# EAGLE design STorM32 NT logger v10 (EAGLE 6.5.0)
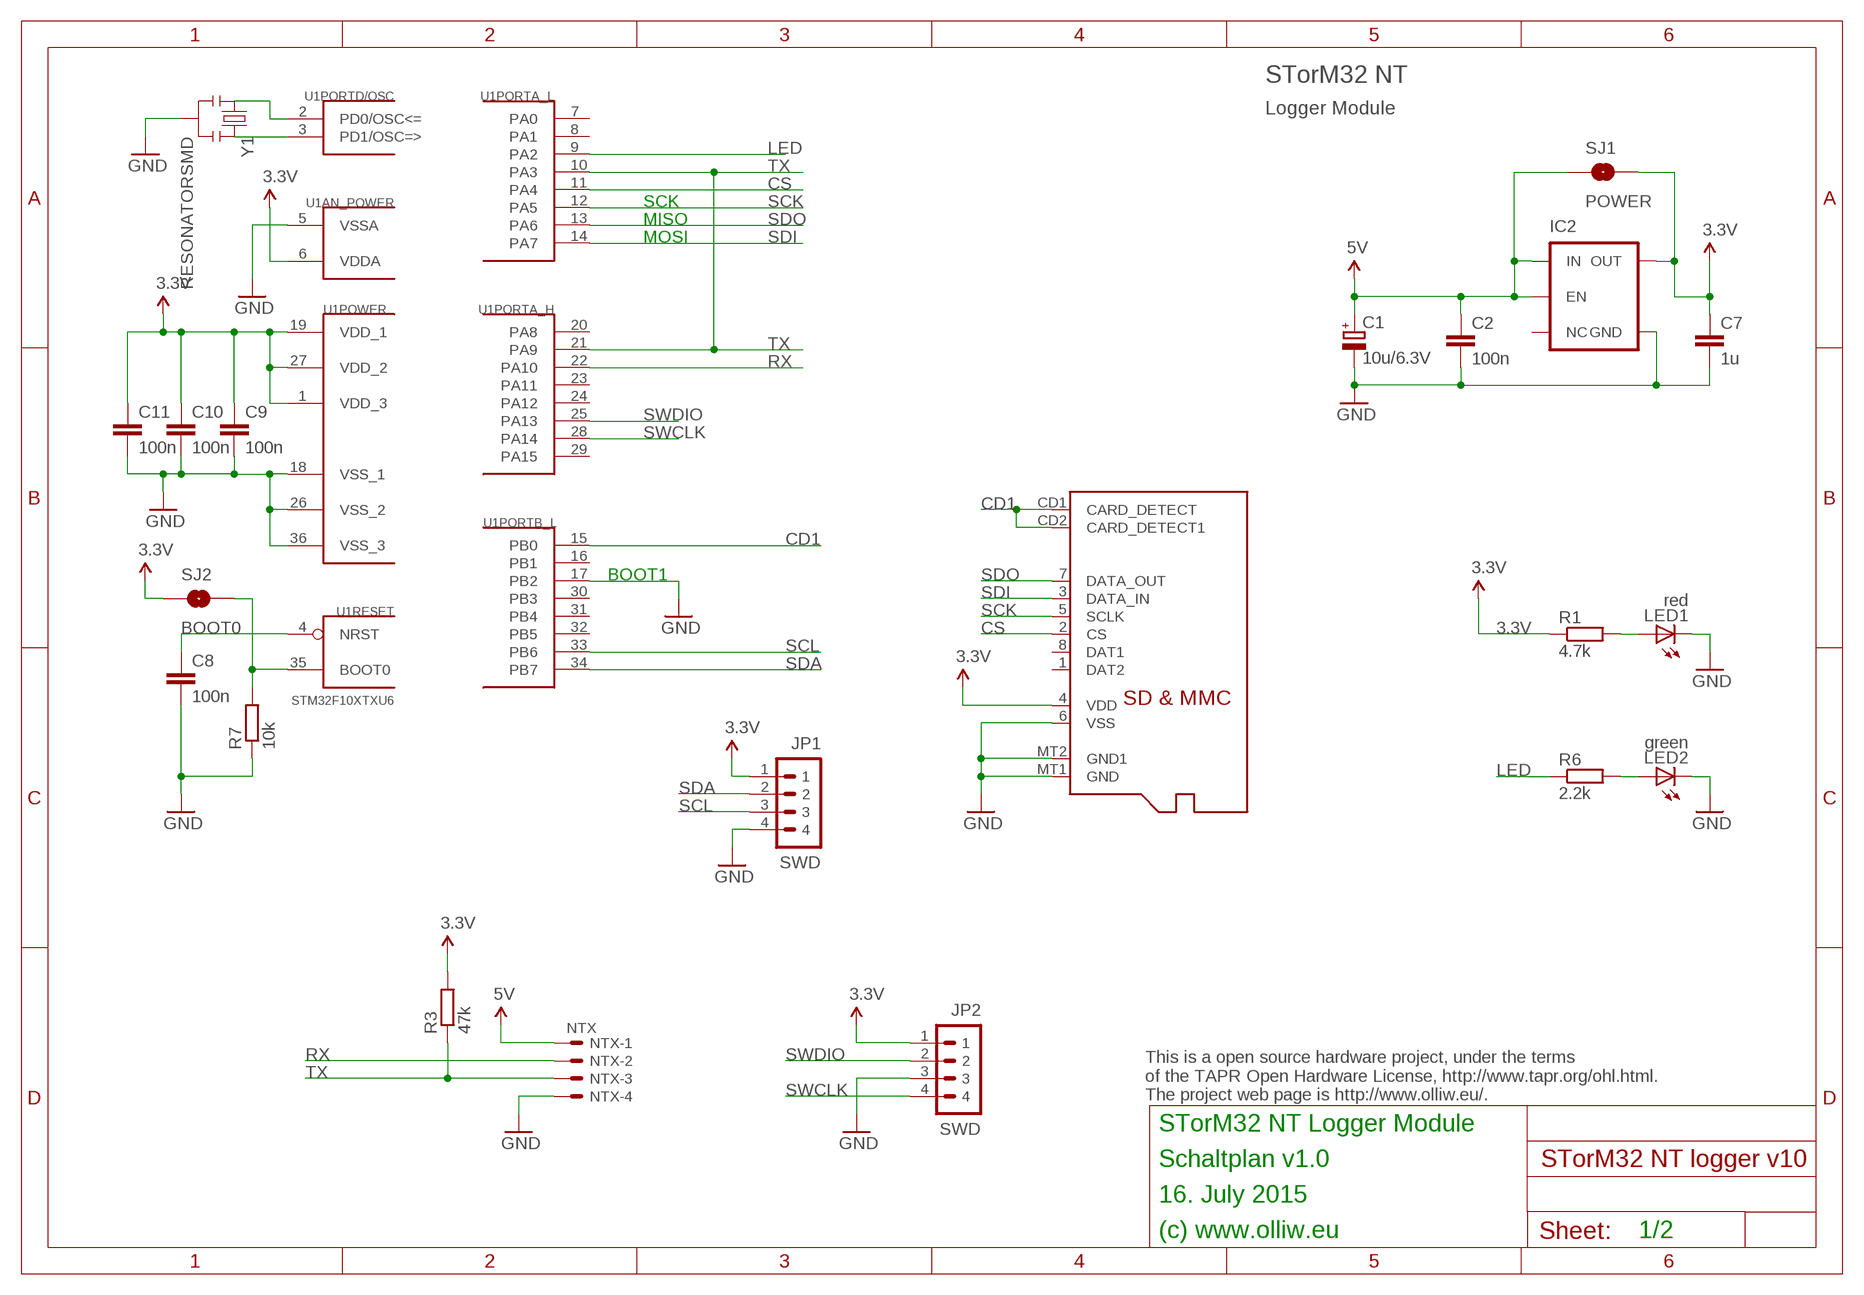
[diagram p0: schematic, sheet 1]

## Parts
C1  10u/6.3V  CPOL-EUSMCB  [SMC_B]
C2  100n  C-EUC0603  [C0603]
C7  1u  C-EUC0603  [C0603]
C8  100n  C-EUC0603  [C0603]
C9  100n  C-EUC0603  [C0603]
C10  100n  C-EUC0603  [C0603]
C11  100n  C-EUC0603  [C0603]
IC2  V_REG_TPS76433SOT23-5  [SOT23-5]
JP1  SWD  P4X1_1P27-OCT_BILEX  [4X1_1P27_OCT_BILEX]
JP2  SWD  P4X1_1P27-OCT_BILEX  [4X1_1P27_OCT_BILEX]
LED1  red  LEDCHIPLED_0603  [CHIPLED_0603]
LED2  green  LEDCHIPLED_0603  [CHIPLED_0603]
NTX  NTX  SM04B-SRSS-TB  [SM04B-SRSS-TB]
R1  4.7k  R-EU_R0603  [R0603]
R3  47k  R-EU_R0603  [R0603]
R6  2.2k  R-EU_R0603  [R0603]
R7  10k  R-EU_R0603  [R0603]
SJ1  POWER  SOLDERJUMPERNO  [SJ_2S-NO]
SJ2  BOOT0  SOLDERJUMPERNO  [SJ_2S-NO]
U1  STM32F10XTXU6  [VFQFPN36]
U$1  MICROSD  [MICROSD]
Y1  RESONATORSMD  [RESONATOR-SMD]

## Nets
3.3V: C7.1 C9.1 C10.1 C11.1 IC2.5(OUT) JP1.1 JP2.1 R1.1 R3.2 SJ1.2 SJ2.1 U1.1(POWER:VDD_3) U1.6(AN_POWER:VDDA) U1.19(POWER:VDD_1) U1.27(POWER:VDD_2) U$1.4(VDD)
5V: C1.+ C2.1 IC2.1(IN) IC2.3(EN) NTX.1 SJ1.1
CD1: U1.15(PORTB_L:PB0) U$1.CD1(CARD_DETECT) U$1.CD2(CARD_DETECT1)
CS: U1.11(PORTA_L:PA4) U$1.2(CS)
GND: C1.- C2.2 C7.2 C8.2 C9.2 C10.2 C11.2 IC2.2(GND) JP1.4 JP2.3 LED1.C LED2.C NTX.4 R7.1 U1.5(AN_POWER:VSSA) U1.17(PORTB_L:PB2) U1.18(POWER:VSS_1) U1.26(POWER:VSS_2) U1.36(POWER:VSS_3) U$1.6(VSS) U$1.MT1(GND) U$1.MT2(GND1) Y1.2
LED: R6.1 U1.9(PORTA_L:PA2)
N$1: C8.1 U1.4(RESET:NRST)
N$2: LED2.A R6.2
N$3: R7.2 SJ2.2 U1.35(RESET:BOOT0)
N$5: U1.2(PORTD/OSC:PD0/OSC<=) Y1.1
N$6: U1.3(PORTD/OSC:PD1/OSC=>) Y1.3
N$9: LED1.A R1.2
RX: NTX.2 U1.22(PORTA_H:PA10)
SCK: U1.12(PORTA_L:PA5) U$1.5(SCLK)
SCL: JP1.3 U1.33(PORTB_L:PB6)
SDA: JP1.2 U1.34(PORTB_L:PB7)
SDI: U1.14(PORTA_L:PA7) U$1.3(DATA_IN)
SDO: U1.13(PORTA_L:PA6) U$1.7(DATA_OUT)
SWCLK: JP2.4 U1.28(PORTA_H:PA14)
SWDIO: JP2.2 U1.25(PORTA_H:PA13)
TX: NTX.3 R3.1 U1.10(PORTA_L:PA3) U1.21(PORTA_H:PA9)
Unconnected: IC2.4(NC) U1.7(PORTA_L:PA0) U1.8(PORTA_L:PA1) U1.16(PORTB_L:PB1) U1.20(PORTA_H:PA8) U1.23(PORTA_H:PA11) U1.24(PORTA_H:PA12) U1.29(PORTA_H:PA15) U1.30(PORTB_L:PB3) U1.31(PORTB_L:PB4) U1.32(PORTB_L:PB5) U$1.1(DAT2) U$1.8(DAT1)

## Notes on the sheet
- STorM32 NT
- Logger Module
- SCK
- MISO
- MOSI
- BOOT1
- This is a open source hardware project, under the terms
  of the TAPR Open Hardware License, http://www.tapr.org/ohl.html.
  The project web page is http://www.olliw.eu/.
- STorM32 NT Logger Module
- Schaltplan v1.0
- 16. July 2015
- (c) www.olliw.eu | 1/2

## Library data of the parts
C1 = rcl:CPOL-EU: POLARIZED CAPACITOR, European symbol
C2 C7-C11 = rcl:C-EU: CAPACITOR, European symbol
IC2 = # SparkFun2:V_REG_TPS76433: Voltage Regulator Older TI part. LDO 150mA regulator. No output by-pass cap option. See V_REG_LDO for a better part.
JP1 JP2 = # stdlib:P4X1_1P27
LED1 LED2 = led:LED: LED OSRAM: - CHIPLED LG R971, LG N971, LY N971, LG Q971, LY Q971, LO R971, LY R971 LH N974, LH R974 LS Q976, LO Q976, LY Q976 LO Q996 - Hyper CHIPLED LW Q18S LB Q993, LB Q99A, LB R99A - SideLED LS A670, LO A670, LY A670, LG A670, LP A670 LB A673, LV A673, LT A673, LW A673 LH A674 LY A675 LS A676, LA A676, LO A676, LY A676, LW A676 LS A679, LY A679, LG A679 - Hyper Micro SIDELED® LS Y876, LA Y876, LO Y876, LY Y876 LT Y87S - SmartLED LW L88C, LW L88S LB L89C, LB L89S, LG L890 LS L89K, LO L89K, LY L89K LS L896, LA L896, LO L896, LY L896 - TOPLED LS T670, LO T670, LY T670, LG T670, LP T670 LSG T670, LSP T670, LSY T670, LOP T670, LYG T670 LG T671, LOG T671, LSG T671 LB T673, LV T673, LT T673, LW T673 LH T674 LS T676, LA T676, LO T676, LY T676, LB T676, LH T676, LSB T676, LW T676 LB T67C, LV T67C, LT T67C, LS T67K, LO T67K, LY T67K, LW E67C LS E67B, LA E67B, LO E67B, LY E67B, LB E67C, LV E67C, LT E67C LW T67C LS T679, LY T679, LG T679 LS T770, LO T770, LY T770, LG T770, LP T770 LB T773, LV T773, LT T773, LW T773 LH T774 LS E675, LA E675, LY E675, LS T675 LS T776, LA T776, LO T776, LY T776, LB T776 LHGB T686 LT T68C, LB T68C - Hyper Mini TOPLED® LB M676 - Mini TOPLED Santana® LG M470 LS M47K, LO M47K, LY M47K Source: http://www.osram.convergy.de LUXEON: - LUMILED® LXK2-PW12-R00, LXK2-PW12-S00, LXK2-PW14-U00, LXK2-PW14-V00 LXK2-PM12-R00, LXK2-PM12-S00, LXK2-PM14-U00 LXK2-PE12-Q00, LXK2-PE12-R00, LXK2-PE12-S00, LXK2-PE14-T00, LXK2-PE14-U00 LXK2-PB12-K00, LXK2-PB12-L00, LXK2-PB12-M00, LXK2-PB14-N00, LXK2-PB14-P00, LXK2-PB14-Q00 LXK2-PR12-L00, LXK2-PR12-M00, LXK2-PR14-Q00, LXK2-PR14-R00 LXK2-PD12-Q00, LXK2-PD12-R00, LXK2-PD12-S00 LXK2-PH12-R00, LXK2-PH12-S00 LXK2-PL12-P00, LXK2-PL12-Q00, LXK2-PL12-R00 Source: www.luxeon.com KINGBRIGHT: KA-3528ASYC Source: www.kingbright.com
NTX = con-jst2:?M04B-SRSS-TB: Disconnectable Crimp style connector, 1.0mm pitch 4 contacts
R1 R3 R6 R7 = rcl:R-EU_: RESISTOR, European symbol
SJ1 SJ2 = # SparkFun2:SOLDERJUMPER: Solder Jumper Standard SMD solder jumper. Used to automate production. Two varients : Normally Open and Normally Closed are the same, but have different paste layers. NC will have a large amount of paste and should jumper during reflow.
U1 = # stm32:STM32F10XTXU6: STM32F101/103 36pad VFQPFN36
U$1 = # adafruit:MICROSD: Micro-SD / Transflash card holder with SPI pinout For the 3M # 2908-05WB-MG and/or 4UCON #19656 push-push type
Y1 = # SparkFun2:RESONATOR: Resonator Small SMD resonator. This is the itty bitty 10/20MHz resonators with built in caps. CSTCE10M0G55 and CSTCE20M0V53. Footprint has been reviewed closely but hasn't been tested yet.

## Board
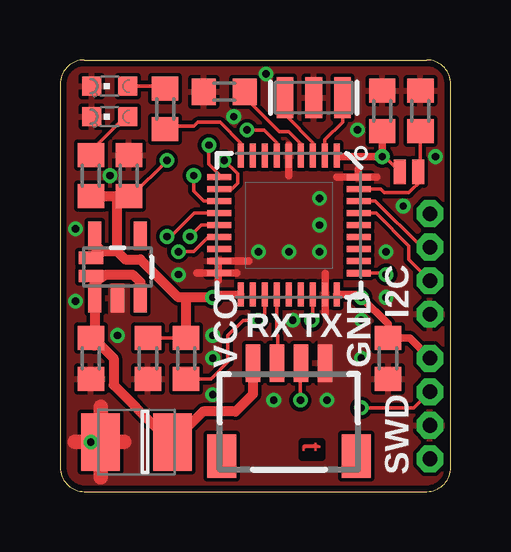
[diagram p1: board, top side]
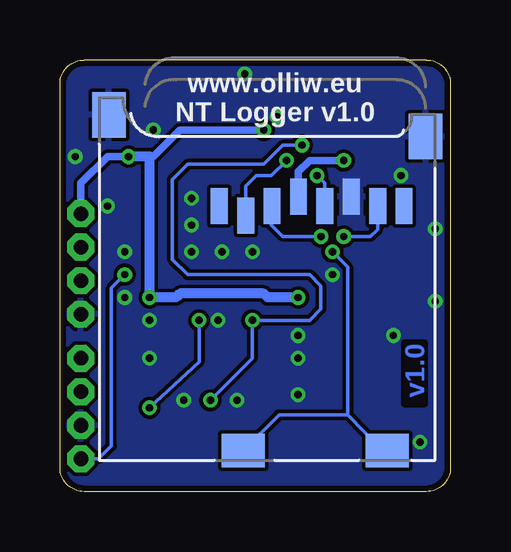
[diagram p2: board, bottom side, seen from below]

Size 16.27 x 18 mm. Coordinates in mm from the lower left corner, seen from the top.
Outline: 1,18 15.27,18 arc-90 16.27,17 16.27,1 arc-90 15.27,0 1,0 arc-90 0,1 0,17 arc-90 1,18
Copper layers (1*16): Top 0.035mm / dielectric 1.5mm / Bottom 0.035mm
Design rules "Fusion_eagle_rule_v1.1-shapes-supply-changed": minimum track width 6mil, minimum drill 12mil, track to track 6mil, track to pad 6mil, pad to pad 6mil, via to via 6mil, smd to smd 0mil, copper to edge 10mil, drill to drill 10mil, minimum pad ring 10mil, minimum via ring 6mil, stop-mask expansion 2mil, vias tented up to drill 100mil, thermal gap 6mil

### Footprints (pad centres in the part's own frame; a part is rotated, then mirrored left to right if it is on the bottom)
SMC_B = smd 1.6 x 2.4: + -1.5,0; - 1.5,0
C0603 = smd 1 x 1.1: 1 -0.85,0; 2 0.85,0
SOT23-5 = smd 0.55 x 1.2: 1 -0.95,-1.3; 2 0,-1.3; 3 0.95,-1.3; 4 0.95,1.3; 5 -0.95,1.3
4X1_1P27_OCT_BILEX = drill 0.61 pad 1.118 octagon: 1 0,0; 2 0,-1.397; 3 0,-2.794; 4 0,-4.191
CHIPLED_0603 = smd 0.8 x 0.8: A 0,-0.75; C 0,0.75
SM04B-SRSS-TB = smd 0.6 x 1.55: 1 -1.5,2.975; 2 -0.5,2.975; 3 0.5,2.975; 4 1.5,2.975 | smd 1.2 x 1.8: FIT@1 -2.8,-0.9; FIT@2 2.8,-0.9
R0603 = smd 1 x 1.1: 1 -0.85,0; 2 0.85,0
SJ_2S-NO = smd 0.508 x 1.016: 1 -0.381,0; 2 0.381,0
VFQFPN36 = smd 1 x 0.25: 1 -2.9,2; 2 -2.9,1.5; 3 -2.9,1; 4 -2.9,0.5; 5 -2.9,0; 6 -2.9,-0.5; 7 -2.9,-1; 8 -2.9,-1.5; 9 -2.9,-2; 19 2.9,-2; 20 2.9,-1.5; 21 2.9,-1; 22 2.9,-0.5; 23 2.9,0; 24 2.9,0.5; 25 2.9,1; 26 2.9,1.5; 27 2.9,2 | smd 0.25 x 1: 10 -2,-2.9; 11 -1.5,-2.9; 12 -1,-2.9; 13 -0.5,-2.9; 14 0,-2.9; 15 0.5,-2.9; 16 1,-2.9; 17 1.5,-2.9; 18 2,-2.9; 29 1.5,2.9; 30 1,2.9; 31 0.5,2.9; 32 0,2.9; 33 -0.5,2.9; 34 -1,2.9; 35 -1.5,2.9; 36 -2,2.9 | smd 0.27 x 1: 28 2,2.9
MICROSD = smd 0.7 x 1.5: 1 9,-10.64; 2 7.9,-10.24; 3 6.8,-10.64; 4 5.7,-11.04; 5 4.6,-10.64; 6 3.5,-11.04; 7 2.4,-10.64; 8 1.3,-10.64 | smd 1.8 x 1.4: CD1 2,-0.44; CD2 8,-0.44 | smd 1.4 x 1.9: MT1 0.4,-13.54; MT2 13.6,-14.44
RESONATOR-SMD = smd 0.7 x 1.7: 1 -1.2,0; 2 0,0; 3 1.2,0

### Placement (x,y rotation side)
C1  3.17,2.06 180 top
C2  1.27,5.56 270 top
C7  3.65,5.56 270 top
C8  6.83,16.67 180 top
C9  13.65,5.56 270 top
C10  2.86,13.18 90 top
C11  13.41,15.88 90 top
IC2  2.38,9.37 0 top
JP1  15.4,11.59 0 top
JP2  15.4,5.56 0 top
LED1  2.06,15.64 90 top
LED2  2.06,16.91 90 top
NTX  9.53,2.38 0 top
R1  1.27,13.18 90 top
R3  5.24,5.56 90 top
R6  4.37,15.95 90 top
R7  15,15.88 270 top
SJ1  1.27,9.37 90 top
SJ2  14.53,13.34 0 top
U1  9.53,11.11 270 top
U$1  0.64,1.27 180 bottom
Y1  10.56,16.43 180 top

### Tracks (layer width: path | path; a pad name or v marks a point on that pad's centre or on a via)
3.3V  (via drill 0.3)
  Top 0.152: 1.59,10.07 1.59,10.16 IC2.5 1.46,10.64 | U1.6 9.03,14.55 8.49,15.08 v7.78,15.08 | C10.1 2.96,12.33 v4.45,13.81 | R3.2 C7.1 | 12.43,8.21 v12.54,8.1 | U1.1 11.57,13.97 | SJ2.1 13.51,13.97 v13.41,13.97
  Top 0.305: JP2.1 14.55,6.41 C9.1 13.65,6.99 v12.54,8.1 | U1.27 12.43,8.21 | U1.19 6.47,8.21 v6.35,8.1 | 11.57,13.97 v13.41,13.97 C11.1
  Top 0.406: 1.59,10.07 SJ1.2 | R1.1 2.38,12.33 | 2.38,12.33 C10.1 | 2.38,10 2.7,9.68 3.33,9.68 4.92,8.1 5.24,8.1 | 2.38,10 2.38,12.33 | 2.38,10 1.75,10 1.59,10.16 | v6.35,8.1 5.24,8.1 | R3.2 5.24,8.1
  Bottom 0.305: U$1.4 6.33,13.35 5.87,13.81 v4.45,13.81 | 12.54,13.97 12.38,13.97 11.27,15.08 v7.78,15.08 | JP1.1 15.4,12.86 14.29,13.97 v13.41,13.97
  Bottom 0.406: v6.35,8.1 7.62,8.1 7.78,8.26 11.27,8.26 11.43,8.1 v12.54,8.1 12.54,13.97 v13.41,13.97
5V
  Top 0.152: 1.53,6.25 C2.1 1.43,6.09 | IC2.3 | SJ1.1 1.5,8.98 1.43,8.73
  Top 0.406: NTX.1 8.03,4.06 7.3,3.33 5.95,3.33 C1.+ 4.13,2.54 2.22,4.45 2.22,5.56 1.53,6.25 | 1.43,6.09 IC2.1 1.43,8.73 1.91,9.05 3.02,9.05 3.33,8.73 IC2.3
CD1  (via drill 0.3)
  Top 0.152: U1.15 6.17,10.61 5.56,10 v4.92,10
  Bottom 0.152: 8.89,1.81 U$1.CD2 7.14,3.2 4.29,3.2 | v4.92,10 4.29,9.37 4.29,3.2 | 4.29,3.2 2.86,1.75 2.7,1.39 U$1.CD1
CS  (via drill 0.3)
  Top 0.152: U1.11 7.14,12.61 7.38,12.86 7.38,13.26 v6.83,13.81
  Bottom 0.152: U$1.2 8.54,12.74 8.1,13.18 7.46,13.18 v6.83,13.81
GND  (via drill 0.3 pad 0.61)
  Top 0.152: U1.17 6.62,9.48 6.59,9.45 | 12.42,13.18 12.58,13.17 U1.36
  Top 0.305: 9.53,14.45 9.53,13.18 | 13.18,13.11 11.51,13.11 | 6.27,9.6 7.86,9.6 | 5.67,9.12 7.34,9.12 | 12.42,13.18 12.42,13.45 | 6.59,8.81 6.59,9.45 | 11.04,7.42 11.04,9.09
  Top 0.61: 1.68,0.59 1.68,3.53 | 2.66,2.08 0.59,2.08
  other vias: 10.79,11.11 10.79,12.22 8.26,10 9.53,10 10.79,10 2.38,6.51 6.35,6.51 11.11,3.81 8.89,3.81 9.68,7.14 4.92,9.05 13.57,10 0.64,10.95 0.64,7.94 1.27,2.06 13.57,8.1 6.35,4.05 6.35,5.56 12.38,15.08 2.06,13.18 12.54,5.56 7.22,15.64 8.57,17.42 15.64,13.97 12.54,7.14 14.29,11.91
  pour Bottom (isolate 0.152): 0.33,17 arc-90 1,17.67 15.27,17.67 arc-90 15.94,17 15.94,1 arc-90 15.27,0.33 1,0.33 arc-90 0.33,1
  pour Top (isolate 0.152): 0.33,17 arc-90 1,17.67 15.27,17.67 arc-90 15.94,17 15.94,1 arc-90 15.27,0.33 1,0.33 arc-90 0.33,1
  pour Top (no thermals): 10.79,6.35 11.75,6.35 11.75,4.13 10.79,4.13
  pour Bottom (isolate 0.254, rank 2, no thermals): 3.65,13.34 3.65,11.27 4.6,11.27 4.6,13.34
  pour Top (no thermals): 2.06,7.3 2.06,8.57 2.22,8.73 2.86,8.73 3.02,8.57 3.02,7.3
LED
  Top 0.152: U1.9 7.53,14.54 6.67,15.4 5.71,15.4 5.56,15.24 4.82,15.24 R6.1
N$1
  Top 0.152: U1.4 10.03,14.5 9.53,15 9.13,15 7.94,16.19 7.94,16.57 C8.1
N$2
  Top 0.152: R6.2 4.03,16.73 4.05,16.91 LED2.A
N$3
  Top 0.152: U1.35 13.34,12.61 13.49,12.46 14.53,12.46 15.08,13.02 15.08,13.27 SJ2.2 15,13.35 R7.2
N$5
  Top 0.152: U1.2 11.03,14.68 11.76,15.41 Y1.1
N$6
  Top 0.152: U1.3 10.53,14.56 9.44,15.65 Y1.3
N$9
  Top 0.152: LED1.A 2.78,15.72 1.27,14.21 R1.2
RX
  Top 0.152: 9.21,5.22 NTX.2 9.05,5.54 9.05,6.51 9.03,6.53 U1.22
SCK  (via drill 0.3)
  Top 0.152: U1.12 5.99,12.11 5.56,12.54 v5.56,13.18
  Bottom 0.152: 5.4,11.91 U$1.5 5.24,12.86 v5.56,13.18
SCL
  Top 0.152: U1.33 13.15,11.61 14.53,10.24 14.53,9.67 JP1.3
SDA
  Top 0.152: U1.34 13.13,12.11 15.05,10.19 JP1.2
SDI  (via drill 0.3)
  Top 0.152: U1.14 5.87,11.11 v5.4,10.64
  Bottom 0.152: v5.4,10.64 6.99,10.64 7.46,11.11 7.46,11.88 U$1.3
SDO  (via drill 0.3)
  Top 0.152: U1.13 5.58,11.61 4.6,10.64 v4.45,10.64
  Bottom 0.152: U$1.7 3.04,10.94 3.33,10.64 v4.45,10.64
SWCLK  (via drill 0.3)
  Top 0.152: U1.28 13.48,9.11 v13.57,9.05
  Bottom 0.152: JP2.4 14.67,1.36 14.13,1.91 14.13,8.49 v13.57,9.05
SWDIO  (via drill 0.3)
  Top 0.152: v12.54,3.49 14.73,3.49 JP2.2 | U1.25 10.53,7.19 v10.48,7.14
  Bottom 0.152: v10.48,7.14 10.48,5.4 v12.54,3.49
TX  (via drill 0.3)
  Top 0.152: U1.21 8.53,7.41 v8.26,7.14 7.62,7.14 6.99,6.51 6.99,5.4 6.29,4.71 R3.1 | U1.10 6.62,13.22 6.19,13.65 v6.19,14.45 | NTX.3 10,5.33 v10,3.81
  Bottom 0.152: v10,3.81 8.26,5.56 v8.26,7.14 5.87,7.14 5.4,7.62 5.4,8.57 5.87,9.05 10.95,9.05 11.59,9.68 11.59,13.02 10.95,13.65 7.78,13.65 6.99,14.45 v6.19,14.45

### Text on the board
Top: t
Bottom: v1.0
tNames: I2C | RX | TX | VCC | GND | SWD
bNames: www.olliw.eu / NT Logger v1.0